# Altium schematic sheet STM32P32.SchDoc
size A4
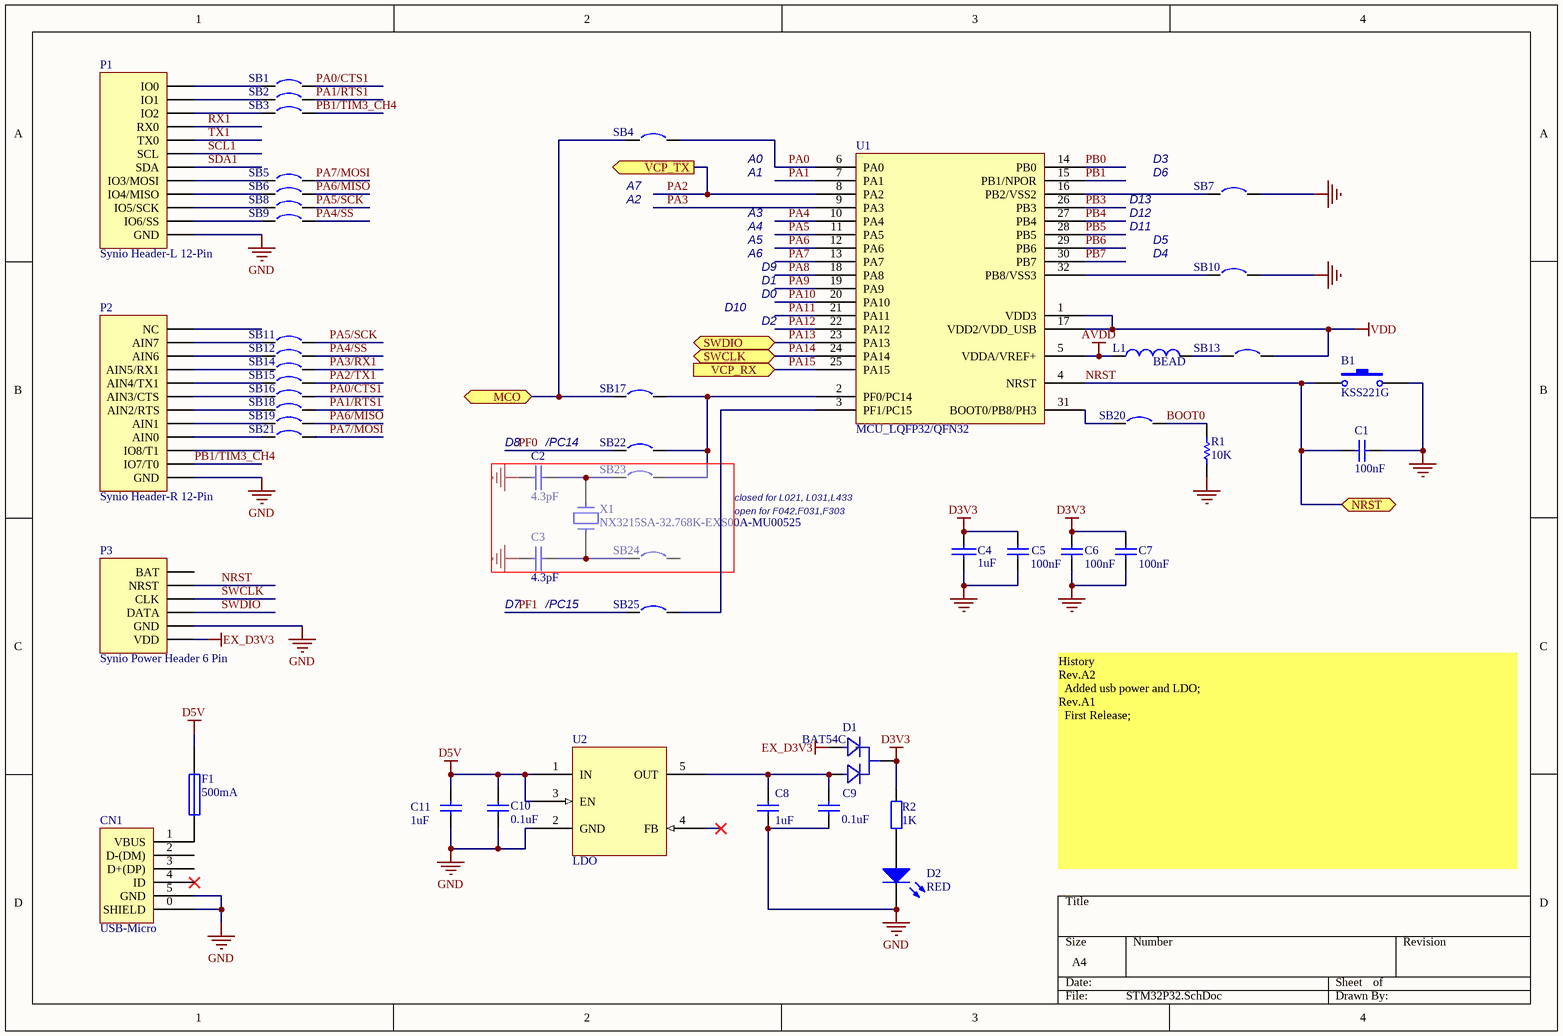
[diagram p0: STM32P32.SchDoc]

## Parts
B1  KSS221G  [SW2_5R6_5R5x3R1]
C1  100nF  [0603C]
C2  4.3pF  [0603C]
C3  4.3pF  [0603C]
C4  1uF  [0603M]
C5  100nF  [0603M]
C6  100nF  [0603M]
C7  100nF  [0603M]
C8  1uF  [0603M]
C9  0.1uF  [0603M]
C10  0.1uF  [0603M]
C11  1uF  [0603M]
CN1  USB-Micro  [USB-MICRO-Female-Lite]
D1  BAT54C  [BAT54C]
D2  RED  [0603pn]
F1  500mA  [0805]
L1  BEAD  [0603L]
P1  Synio Header-L 12-Pin  [HDR1X12/2.54MM]
P2  Synio Header-R 12-Pin  [HDR1X12/2.54MM]
P3  Synio Power Header 6 Pin  [HDR1X6/2.54MM]
R1  10K  [0603R]
R2  1K  [0603M]
SB1  Circuit Breaker  [JP2_SMD]  (value not drawn)
SB2  Circuit Breaker  [JP2_SMD]  (value not drawn)
SB3  Circuit Breaker  [JP2_SMD]  (value not drawn)
SB4  Circuit Breaker (open)  [SB_0603]  (value not drawn)
SB5  Circuit Breaker  [JP2_SMD]  (value not drawn)
SB6  Circuit Breaker  [JP2_SMD]  (value not drawn)
SB7  Circuit Breaker (close)  [SB_0603]  (value not drawn)
SB8  Circuit Breaker  [JP2_SMD]  (value not drawn)
SB9  Circuit Breaker  [JP2_SMD]  (value not drawn)
SB10  Circuit Breaker (close)  [SB_0603]  (value not drawn)
SB11  Circuit Breaker  [JP2_SMD]  (value not drawn)
SB12  Circuit Breaker  [JP2_SMD]  (value not drawn)
SB13  Circuit Breaker (close)  [SB_0603]  (value not drawn)
SB14  Circuit Breaker  [JP2_SMD]  (value not drawn)
SB15  Circuit Breaker  [JP2_SMD]  (value not drawn)
SB16  Circuit Breaker  [JP2_SMD]  (value not drawn)
SB17  Circuit Breaker (open)  [SB_0603]  (value not drawn)
SB18  Circuit Breaker  [JP2_SMD]  (value not drawn)
SB19  Circuit Breaker  [JP2_SMD]  (value not drawn)
SB20  Circuit Breaker (close)  [SB_0603]  (value not drawn)
SB21  Circuit Breaker  [JP2_SMD]  (value not drawn)
SB22  Circuit Breaker  [SB_0603]  (value not drawn)
SB23  Circuit Breaker  [SB_0603]  (value not drawn)
SB24  Circuit Breaker  [SB_0603]  (value not drawn)
SB25  Circuit Breaker  [SB_0603]  (value not drawn)
U1  MCU_LQFP32/QFN32  [LQFP32_0R5_7x7]
U2  LDO  [SOT23-5L]
X1  NX3215SA-32.768K-EXS00A-MU00525  [XTAL_2SM_3R2X1R5]

## Ports
MCO, NRST, SWCLK, SWDIO, VCP_RX (in), VCP_TX (out)

## Nets
AVDD: L1.1 U1.5(VDDA/VREF+)
D3V3: C4.1 C5.1 C6.1 C7.1 D1.3 R2.2
D5V: C10.2 C11.2 F1.1 U2.1(IN) U2.3(EN)
EX_D3V3: D1.1 P3.1(VDD)
GND: B1.2 C1.1 C2.2 C3.2 C4.2 C5.2 C6.2 C7.2 C8.1 C9.1 C10.1 C11.1 CN1.0(SHIELD) CN1.5(GND) D2.2(K) P1.1(GND) P2.1(GND) P3.2(GND) R1.2 SB7.2 SB10.2 U2.2(GND)
VDD: SB13.2 U1.1(VDD3) U1.17(VDD2/VDD_USB)
BOOT0: R1.1 SB20.2
MCO: SB4.1 SB17.1 ; port MCO
NRST: B1.1 C1.2 P3.5(NRST) U1.4(NRST) ; port NRST
PA0: SB4.2 U1.6(PA0)
PA0/CTS1: SB1.2 SB16.2
PA1: U1.7(PA1)
PA1/RTS1: SB2.2 SB18.2
PA2: U1.8(PA2) ; port VCP_TX
PA2/TX1: SB15.2
PA3: U1.9(PA3)
PA3/RX1: SB14.2
PA4: U1.10(PA4)
PA4/SS: SB9.2 SB12.2
PA5: U1.11(PA5)
PA5/SCK: SB8.2 SB11.2
PA6: U1.12(PA6)
PA6/MISO: SB6.2 SB19.2
PA7: U1.13(PA7)
PA7/MOSI: SB5.2 SB21.2
PA8: U1.18(PA8)
PA9: U1.19(PA9)
PA10: U1.20(PA10)
PA11: U1.21(PA11)
PA12: U1.22(PA12)
PA13: U1.23(PA13) ; port SWDIO
PA14: U1.24(PA14) ; port SWCLK
PA15: U1.25(PA15) ; port VCP_RX
PB0: U1.14(PB0)
PB1: U1.15(PB1/NPOR)
PB1/TIM3_CH4: P2.2(IO7/T0) SB3.2
PB3: U1.26(PB3)
PB4: U1.27(PB4)
PB5: U1.28(PB5)
PB6: U1.29(PB6)
PB7: U1.30(PB7)
PF0: SB22.1
PF1: SB25.1
RX1: P1.9(RX0)
SCL1: P1.7(SCL)
SDA1: P1.6(SDA)
SWCLK: P3.4(CLK)
SWDIO: P3.3(DATA)
TX1: P1.8(TX0)
NetC2_1: C2.1 SB23.1 X1.1
NetC3_1: C3.1 SB24.1 X1.2
NetC8_2: C8.2 C9.2 D1.2 U2.5(OUT)
NetCN1_1: CN1.1(VBUS) F1.2
NetD2_1: D2.1(A) R2.1
NetL1_2: L1.2 SB13.1
NetP1_2: P1.2(IO6/SS) SB9.1
NetP1_3: P1.3(IO5/SCK) SB8.1
NetP1_4: P1.4(IO4/MISO) SB6.1
NetP1_5: P1.5(IO3/MOSI) SB5.1
NetP1_10: P1.10(IO2) SB3.1
NetP1_11: P1.11(IO1) SB2.1
NetP1_12: P1.12(IO0) SB1.1
NetP2_4: P2.4(AIN0) SB21.1
NetP2_5: P2.5(AIN1) SB19.1
NetP2_6: P2.6(AIN2/RTS) SB18.1
NetP2_7: P2.7(AIN3/CTS) SB16.1
NetP2_8: P2.8(AIN4/TX1) SB15.1
NetP2_9: P2.9(AIN5/RX1) SB14.1
NetP2_10: P2.10(AIN6) SB12.1
NetP2_11: P2.11(AIN7) SB11.1
NetSB7_1: SB7.1 U1.16(PB2/VSS2)
NetSB10_1: SB10.1 U1.32(PB8/VSS3)
NetSB17_2: SB17.2 SB22.2 SB23.2 U1.2(PF0/PC14)
NetSB20_1: SB20.1 U1.31(BOOT0/PB8/PH3)
NetSB25_2: SB25.2 U1.3(PF1/PC15)

Not connected (* = marked no-connect by the designer): CN1 2(D-(DM)) 3(D+(DP)) 4(ID)*; P2 3(IO8/T1) 12(NC); P3 6(BAT); SB24 2; U2 4(FB)*

## Notes on the sheet
- A0
- A1
- D3
- D6
- A2
- (near SB4) A7
- A3
- A5
- A4
- D11
- (near SB7) D13
- D12
- D5
- A6
- D10
- D0
- D9
- D1
- D4
- D2
- (near C2) D8
- (near C2) /PC14
- closed for L021, L031,L433
- open for F042,F031,F303
- (near C3) D7
- /PC15
- History
  Rev.A2
  Added usb power and LDO;
  Rev.A1
  First Release;

## Library data of the parts
B1 = SW-PB: Switch; Published: 24-Mar-1999; LatestRevisionDate: 17-Jul-2002; LatestRevisionNote: Re-released for DXP Platform.; PackageReference: SPST-2; Publisher: Altium Limited
C1 = CAP: Capacitor; Value: 100pF; Published: 8-Jun-2000; Revision: July-2002: Re-released for DXP Platform.; Publisher: Altium Limited
C2-C4 = CAP: Capacitor
C5-C7 = Cap: Capacitor; Value: 10nF; Published: 8-Jun-2000; Revision: July-2002: Re-released for DXP Platform.; Publisher: Altium Limited
C8-C11 = Cap: Capacitor; Published: 8-Jun-2000; LatestRevisionDate: 17-Jul-2002; LatestRevisionNote: Re-released for DXP Platform.; PackageReference: RAD-0.3
  C8 C11: Value: 1uF
  C9 C10: Value: 0.1uF
D1 = BAT54C: DOUBLE SHOTTKEY DIODES
D2 = LED0: Typical INFRARED GaAs LED; Published: 8-Jun-2000; LatestRevisionDate: 08-Jul-2005; LatestRevisionNote: Mech Layer 1 removed.; PackageReference: LED-0; Publisher: Altium Limited
F1 = Fuse 1: Fuse; Published: 8-Jun-2000; LatestRevisionDate: 17-Jul-2002; LatestRevisionNote: Re-released for DXP Platform.; PackageReference: PIN-W2/E2.8; Publisher: Altium Limited; PackageDescription: Thru-Hole; 2 Leads
L1 = Inductor: Value: 100uH; Published: 8-Jun-2000; Revision: July-2002: Re-released for DXP Platform.; Publisher: Altium Limited
P1 = Synio Header-L 12-Pin: Synio Header-L, 12-Pin; LatestRevisionDate: 17-Jul-2002; LatestRevisionNote: Re-released for DXP Platform.; Publisher: Altium Limited
P2 = Synio Header-R 12-Pin: Synio Header-R, 12-Pin; LatestRevisionDate: 17-Jul-2002; LatestRevisionNote: Re-released for DXP Platform.; Publisher: Altium Limited
R1 = res1: Resistor; Value: 1K; Published: 8-Jun-2000; Revision: July-2002: Re-released for DXP Platform.; Publisher: Altium Limited
R2 = Res2: Resistor; Published: 8-Jun-2000; LatestRevisionDate: 17-Jul-2002; LatestRevisionNote: Re-released for DXP Platform.; PackageReference: AXIAL-0.4; Publisher: Altium Limited; Value: 1K
SB1-SB3 SB5 SB6 SB8 SB9 SB11 SB12 SB14-SB16 SB18 SB19 SB21 = Circuit Breaker: Solder: YES; Published: 24-Mar-1999; Revision: July-2002: Re-released for DXP Platform.; Publisher: Altium Limited
SB4 SB7 SB10 SB13 SB17 SB20 SB22-SB25 = Circuit Breaker: Solder: NO; Published: 24-Mar-1999; Revision: July-2002: Re-released for DXP Platform.; Publisher: Altium Limited
U1 = MCU_LQFP32
U2 = LDO-SOT23-5: General LDO SOT23-5
X1 = CRYSTAL_32K: Crystal